# EAGLE design PCB-REMCON-E (EAGLE 7.1.0)
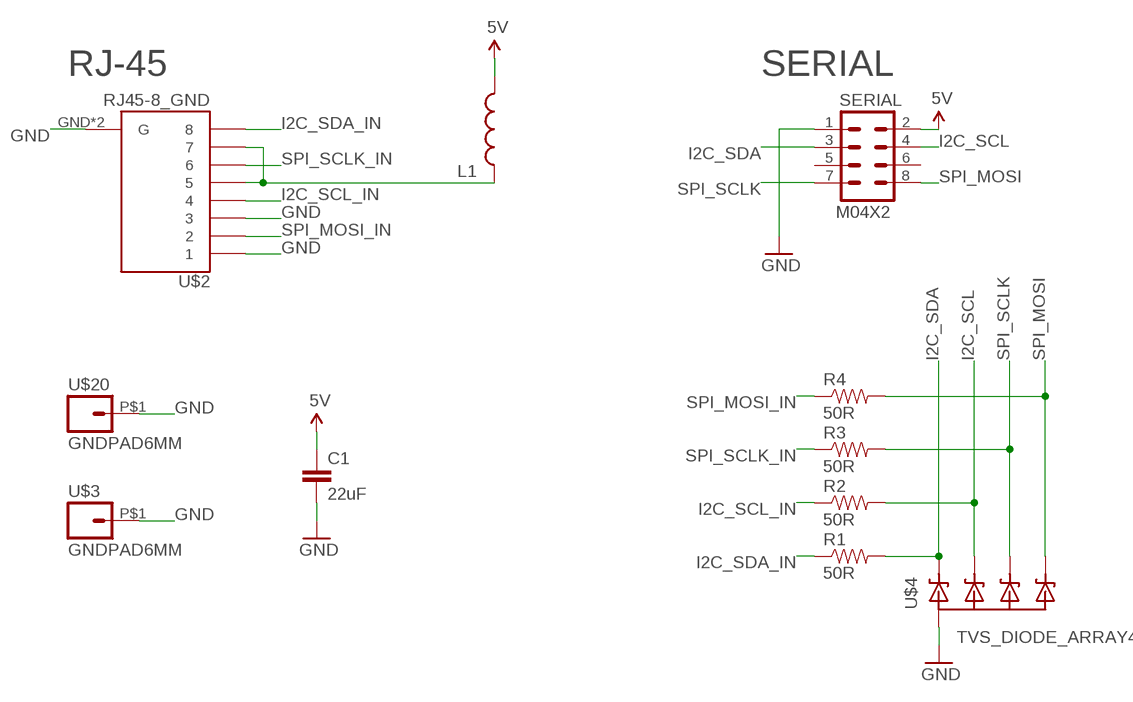
[diagram p0: schematic, sheet 1]

## Parts
C1  22uF  CAP0805  [0805]
L1  INDUCTOR0805  [0805]
R1  50R  RESISTOR0603-RES  [0603-RES]
R2  50R  RESISTOR0603-RES  [0603-RES]
R3  50R  RESISTOR0603-RES  [0603-RES]
R4  50R  RESISTOR0603-RES  [0603-RES]
SERIAL  M04X2  [2X4]
U$2  RJ45-8_GND  [RJ45-8_GND]
U$3  GNDPAD6MM  [3.2MMPAD6MM]
U$4  TVS_DIODE_ARRAY4  [SOT23-6L]
U$20  GNDPAD6MM  [3.2MMPAD6MM]

## Nets
5V [Power]: C1.1 L1.2 SERIAL.2
GND [Power]: C1.2 SERIAL.1 U$2.1 U$2.3 U$2.GND1(G) U$2.GND(G) U$3.P$1 U$4.2(GND) U$4.5(GND) U$20.P$1
I2C_SCL: R2.2 SERIAL.4 U$4.3(B)
I2C_SCL_IN: R2.1 U$2.4
I2C_SDA: R1.2 SERIAL.3 U$4.1(A)
I2C_SDA_IN: R1.1 U$2.8
N$1: L1.1 U$2.5 U$2.7
SPI_MOSI: R4.2 SERIAL.8 U$4.6(D)
SPI_MOSI_IN: R4.1 U$2.2
SPI_SCLK: R3.2 SERIAL.7 U$4.4(C)
SPI_SCLK_IN: R3.1 U$2.6
Unconnected: SERIAL.5 SERIAL.6

## Notes on the sheet
- RJ-45 | SERIAL

## Library data of the parts
C1 = SparkFun:CAP: Capacitor Standard 0603 ceramic capacitor, and 0.1" leaded capacitor.
L1 = SparkFun:INDUCTOR: Inductors Basic Inductor/Choke - 0603 and 1206. Footprints are not proven and vary greatly between part numbers.
R1-R4 = SparkFun:RESISTOR: Resistor Basic schematic elements and footprints for 0603, 1206, and PTH resistors.
SERIAL = SparkFun:M04X2
U$2 = SKAARHOJ:RJ45-8_GND
U$3 U$20 = SKAARHOJ:GNDPAD
U$4 = SKAARHOJ:TVS_DIODE_ARRAY4

## Net classes
0 default: width 0.203 mm, drill 0.406 mm, clearance 0.203 mm
1 Power: width 0.406 mm, drill 0.61 mm, clearance 0.203 mm

## Board
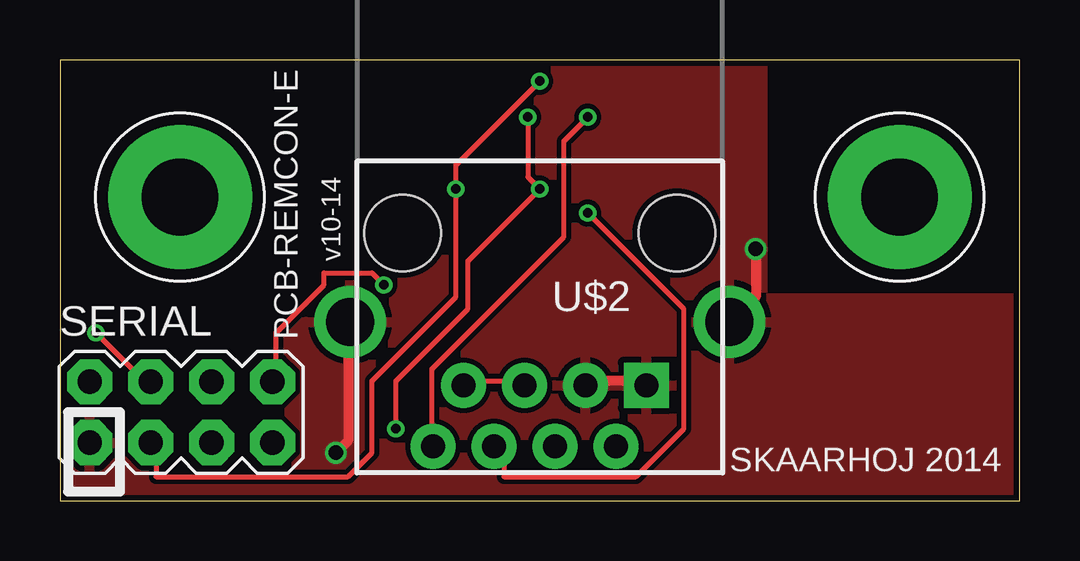
[diagram p1: board, top side]
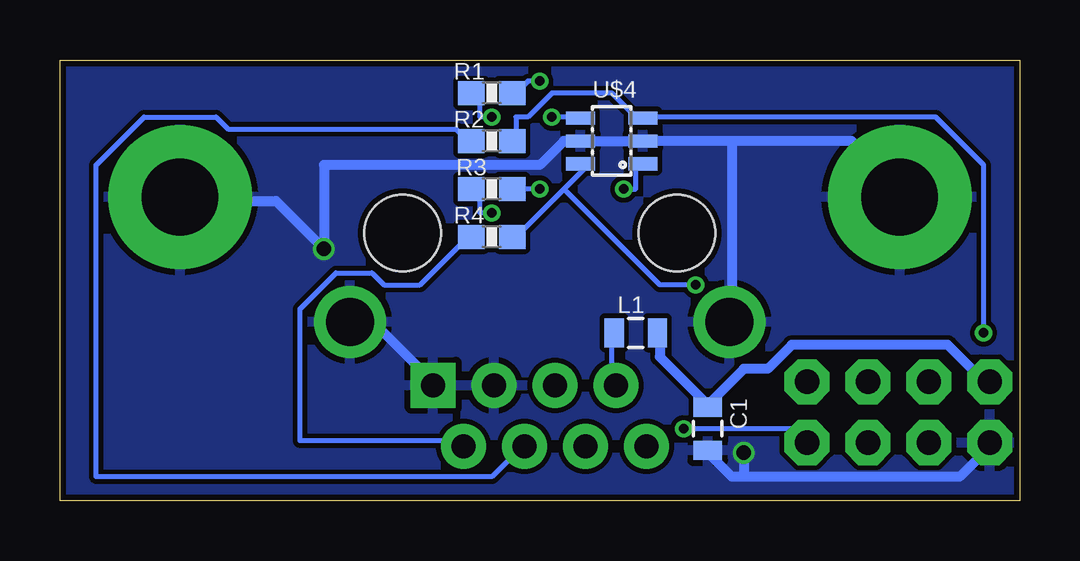
[diagram p2: board, bottom side, seen from below]

Size 40 x 18.38 mm. Coordinates in mm from the lower left corner, seen from the top.
Outline: 0,18.38 0,0 40,0 40,18.38 0,18.38
Copper layers (1*16): Top 0.035mm / dielectric 1.5mm / Bottom 0.035mm
Design rules "Fusion_eagle_rule_v1.1": minimum track width 6mil, minimum drill 12mil, track to track 6mil, track to pad 6mil, pad to pad 6mil, via to via 6mil, smd to smd 0mil, copper to edge 10mil, drill to drill 10mil, minimum pad ring 10mil, minimum via ring 6mil, stop-mask expansion 2mil, vias tented up to drill 100mil, thermal gap 10mil
tRestrict: area 29.5,8.7 to 40,19.2; area 0,8.7 to 10.5,19.2

### Footprints (pad centres in the part's own frame; a part is rotated, then mirrored left to right if it is on the bottom)
0805 = smd 0.8 x 1.2: 1 -0.9,0; 2 0.9,0
0603-RES = smd 1.1 x 1: 1 -0.85,0; 2 0.85,0
2X4 = drill 1.016 pad 1.88 octagon: 1 -3.81,-1.27; 2 -3.81,1.27; 3 -1.27,-1.27; 4 -1.27,1.27; 5 1.27,-1.27; 6 1.27,1.27; 7 3.81,-1.27; 8 3.81,1.27
RJ45-8_GND = drill 1 pad 1.88 square: 1 -4.445,6.35 | drill 1 pad 1.88: 2 -3.175,8.89; 3 -1.905,6.35; 4 -0.635,8.89; 5 0.635,6.35; 6 1.905,8.89; 7 3.175,6.35; 8 4.445,8.89 | drill 2: GND -7.9,3.7; GND1 7.9,3.7 | hole 3.2: -5.715,0; 5.715,0
3.2MMPAD6MM = drill 3.2 pad 6: P$1 0,0
SOT23-6L = smd 0.55 x 1.2: 1 -0.95,-1.3; 2 0,-1.3; 3 0.95,-1.3; 4 0.95,1.3; 5 0,1.3; 6 -0.95,1.3

### Placement (x,y rotation side)
C1  13,3 270 bottom
L1  16,7 0 bottom
R1  22,17 0 bottom
R2  22,15 0 bottom
R3  22,13 0 bottom
R4  22,11 0 bottom
SERIAL  5.05,3.69 0 top
U$2  20,11.16 180 top
U$3  35,12.66 0 top
U$4  17,15 90 bottom
U$20  5,12.66 0 top

### Tracks (layer width: path | path; a pad name or v marks a point on that pad's centre or on a via)
5V
  Bottom 0.406: 13,4 15,6 15,7 L1.2 | 13,4 11.5,5.5 10.5,5.5 9.5,6.5 3,6.5 1.5,5 SERIAL.2 | 13,4 C1.1
GND  (via drill 0.61)
  Top 0.406: U$2.3 22,5 24,5 U$2.1 | v29,10.5 29,8.5 28,7.5 U$2.GND | v11.5,2 12,2.5 12,7 U$2.GND1
  Bottom 0.406: U$2.1 24.5,5 26.5,7 27.5,7 U$2.GND | U$3.P$1 35,12.5 31,12.5 v29,10.5 29,14 20,14 19,15 U$4.5 U$4.2 12,15 | 11.5,1 2.5,1 1.5,2 SERIAL.1 | 11.5,1 12,1 13,2 C1.2 | 12,15 7,15 5,13 U$20.P$1 | 12,15 12,7.5 U$2.GND1 | v11.5,2 11.5,1
  pour Top: 0,0 40,0 40,19 0,19
  pour Bottom: 0,0 40,0 40,19 0,19
I2C_SCL  (via drill 0.41)
  Top 0.203: v1.5,7 3.5,5 SERIAL.4
  Bottom 0.203: R2.2 21,15 21,16 20.5,16 19.5,17 17,17 16,16 U$4.3 15.5,16 3.5,16 1.5,14 v1.5,7
I2C_SCL_IN
  Bottom 0.203: R2.1 23,15 23.5,15.5 33,15.5 33.5,16 36.5,16 38.5,14 38.5,1 22,1 21,2 U$2.4
I2C_SDA  (via drill 0.41)
  Top 0.203: v20,17.5 16.5,14 v16.5,13 16.5,8.5 13,5 13,2 12,1 4,1 4,2 SERIAL.3
  Bottom 0.203: v20,17.5 20.5,17.5 21,17 R1.2 | v16.5,13 16,13 16,14 U$4.1
I2C_SDA_IN  (via drill 0.41)
  Top 0.203: v22,16 21,15 21,11 15.5,5.5 15.5,2.5 U$2.8
  Bottom 0.203: v22,16 22.5,16 22.5,17 R1.1
N$1
  Top 0.203: U$2.5 19,5 17,5 U$2.7
  Bottom 0.203: L1.1 17,7 17,5 U$2.7
SPI_MOSI  (via drill 0.41)
  Top 0.203: v13.5,9 13,9.5 11,9.5 11,9 9,7 9,5 SERIAL.8
  Bottom 0.203: 19,13 18,14 U$4.6 | 19,13 21,11 R4.2 | 19,13 15,9 v13.5,9
SPI_MOSI_IN
  Bottom 0.203: R4.1 23,11 25,9 26.5,9 27,9.5 28.5,9.5 30,8 30,2.5 23.5,2.5 U$2.2
SPI_SCLK  (via drill 0.41)
  Top 0.203: v19.5,16 19.5,13.5 v20,13 17,10 17,8 14,5 v14,3
  Bottom 0.203: v20,13 R3.2 | v19.5,16 18.5,16 U$4.4 | v14,3 9.5,3 9,2.5 SERIAL.7
SPI_SCLK_IN  (via drill 0.41)
  Top 0.203: v22,12 26,8 26,3 24,1 18.5,1 18.5,2 U$2.6
  Bottom 0.203: v22,12 22.5,12 22.5,13 R3.1

### Text on the board
_tsilk: v10-14 | PCB-REMCON-E | SKAARHOJ 2014